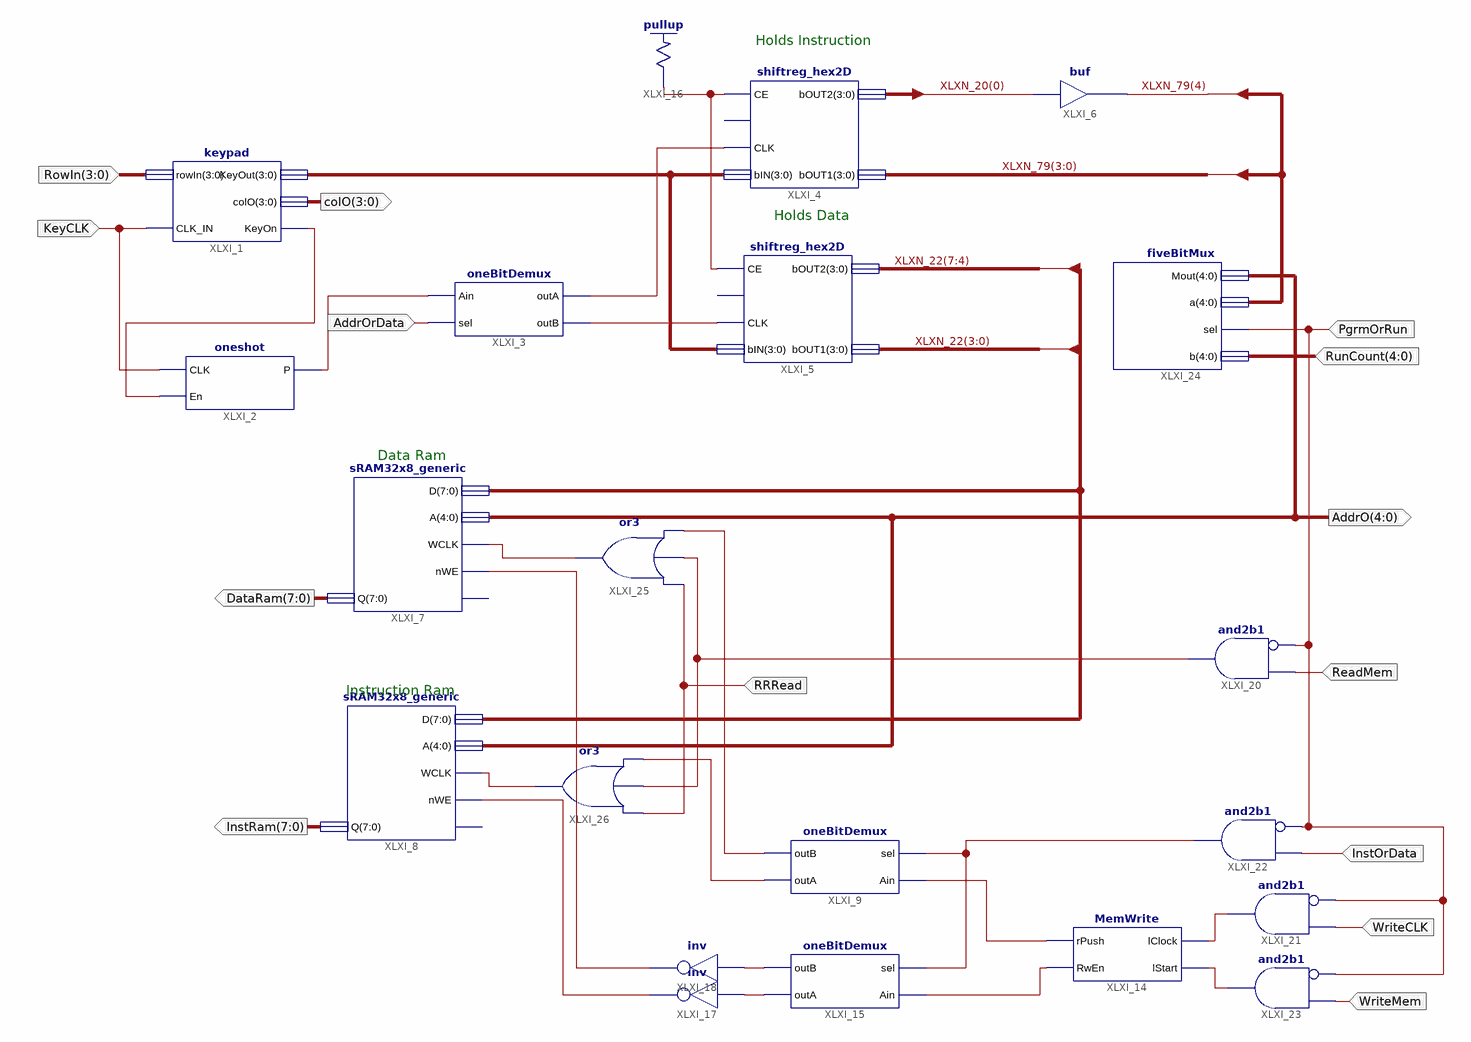
[diagram p0: schematic sheet 1]
// Xilinx ISE schematic KeyAndMemory.sch (spartan3e) as structural Verilog: 21 symbols, 14 ports
module KeyAndMemory (
  input  [3:0] RowIn,
  input  KeyCLK,
  input  AddrOrData,
  input  [4:0] RunCount,
  input  PgrmOrRun,
  input  ReadMem,
  input  InstOrData,
  input  WriteCLK,
  input  WriteMem,
  input  RRRead,
  output [3:0] colO,
  output [7:0] DataRam,
  output [7:0] InstRam,
  output [4:0] AddrO
);

  wire khiv, XLXN_6, XLXN_8, XLXN_39, XLXN_42, XLXN_43, XLXN_44, XLXN_45, XLXN_46, XLXN_47, XLXN_48, XLXN_50,
       XLXN_68, XLXN_78, XLXN_80, XLXN_81, XLXN_82, XLXN_83, XLXN_84;
  wire [3:0] XLXN_9, XLXN_20;
  wire [4:0] XLXN_79;
  wire [7:0] XLXN_22;

  keypad XLXI_1 (.rowIn(RowIn), .CLK_IN(KeyCLK), .KeyOut(XLXN_9), .colO(colO), .KeyOn(XLXN_50));
  oneshot XLXI_2 (.CLK(KeyCLK), .En(XLXN_50), .P(XLXN_6));
  oneBitDemux XLXI_3 (.Ain(XLXN_6), .sel(AddrOrData), .outA(XLXN_42), .outB(XLXN_8));
  shiftreg_hex2D XLXI_4 (
    .CE(XLXN_43), .CLK(XLXN_42), .bIN(XLXN_9), .bOUT2(XLXN_20), .bOUT1(XLXN_79[3:0]));  // open: RST
  shiftreg_hex2D XLXI_5 (
    .CE(XLXN_43), .CLK(XLXN_8), .bIN(XLXN_9), .bOUT2(XLXN_22[7:4]), .bOUT1(XLXN_22[3:0]));  // open: RST
  buf XLXI_6 (XLXN_79[4], XLXN_20[0]);
  sRAM32x8_generic XLXI_7 (.nWE(XLXN_47), .WCLK(XLXN_80), .A(AddrO), .D(XLXN_22), .Q(DataRam));  // open: nCS
  sRAM32x8_generic XLXI_8 (.nWE(XLXN_46), .WCLK(XLXN_81), .A(AddrO), .D(XLXN_22), .Q(InstRam));  // open: nCS
  oneBitDemux XLXI_9 (.Ain(XLXN_48), .sel(khiv), .outA(XLXN_83), .outB(XLXN_82));
  MemWrite XLXI_14 (.lStart(XLXN_78), .lClock(XLXN_68), .RwEn(XLXN_39), .rPush(XLXN_48));
  oneBitDemux XLXI_15 (.Ain(XLXN_39), .sel(khiv), .outA(XLXN_45), .outB(XLXN_44));
  \pullup  XLXI_16 (.O(XLXN_43));
  not XLXI_17 (XLXN_46, XLXN_45);
  not XLXI_18 (XLXN_47, XLXN_44);
  and XLXI_20 (XLXN_84, ~PgrmOrRun, ReadMem);  // and2b1
  and XLXI_21 (XLXN_68, ~PgrmOrRun, WriteCLK);  // and2b1
  and XLXI_22 (khiv, ~PgrmOrRun, InstOrData);  // and2b1
  and XLXI_23 (XLXN_78, ~PgrmOrRun, WriteMem);  // and2b1
  fiveBitMux XLXI_24 (.a(XLXN_79), .b(RunCount), .sel(PgrmOrRun), .Mout(AddrO));
  or XLXI_26 (XLXN_81, XLXN_83, XLXN_84, RRRead);
  or XLXI_25 (XLXN_80, XLXN_82, XLXN_84, RRRead);

  // Notes on the sheet:
  //   Holds Instruction
  //   Holds Data
  //   Data Ram
  //   Instruction Ram
endmodule
